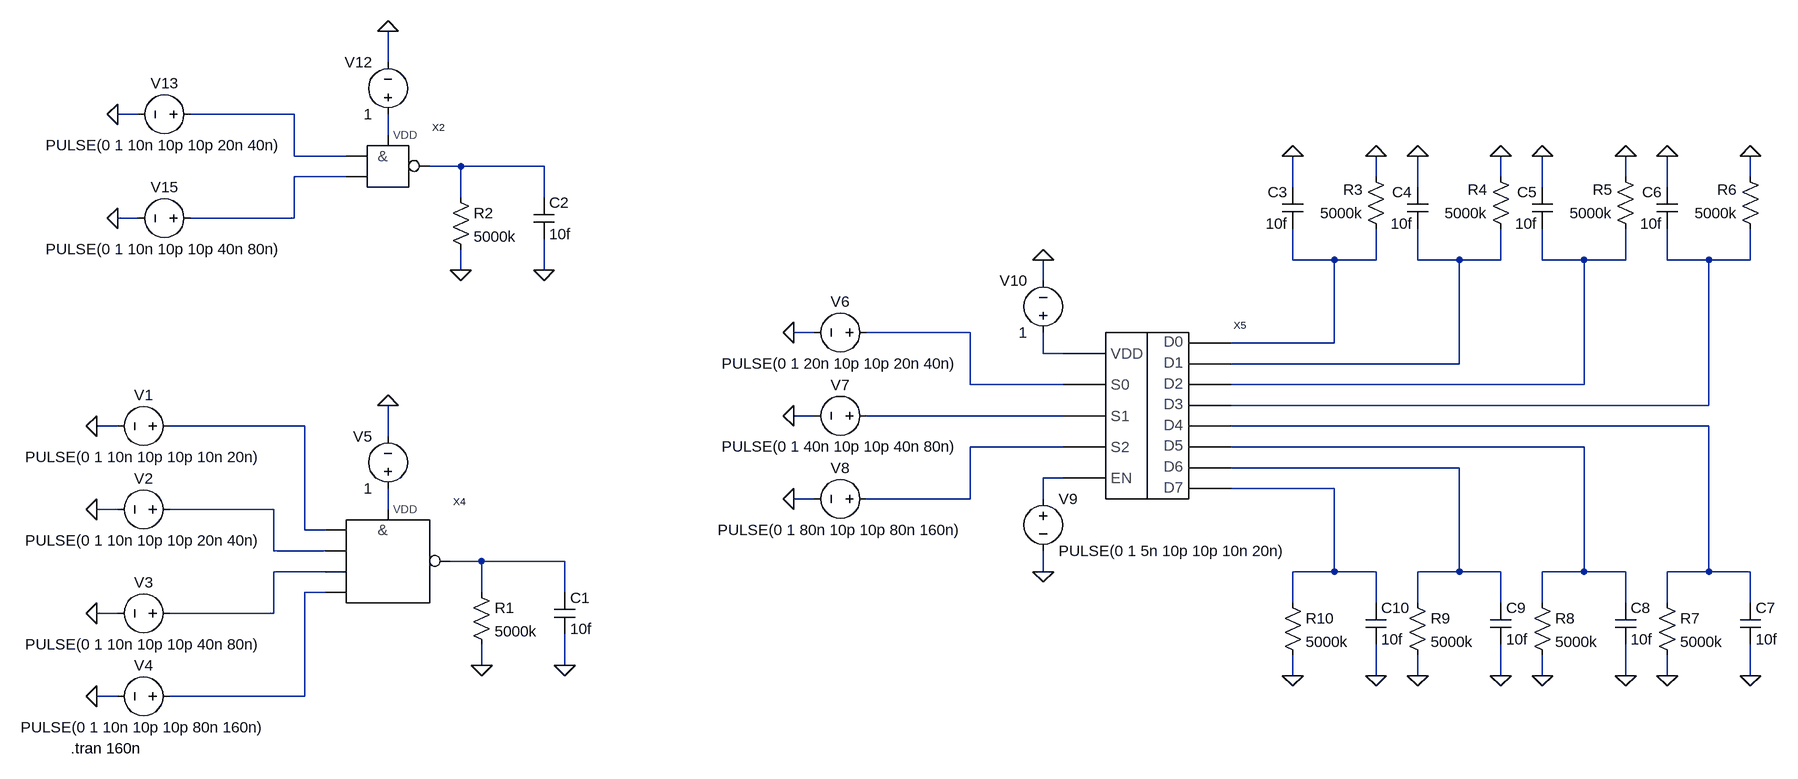
[diagram p0: schematic Draft4.asc]
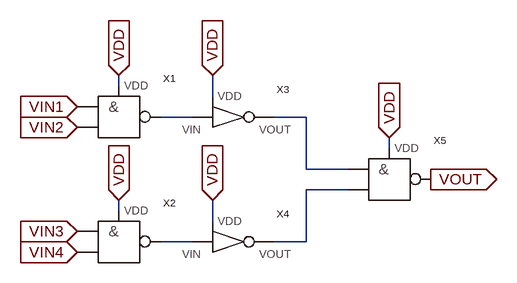
[diagram p1: sub-circuit nand_4.asc]
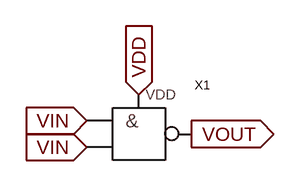
[diagram p2: sub-circuit inverter_2.asc]
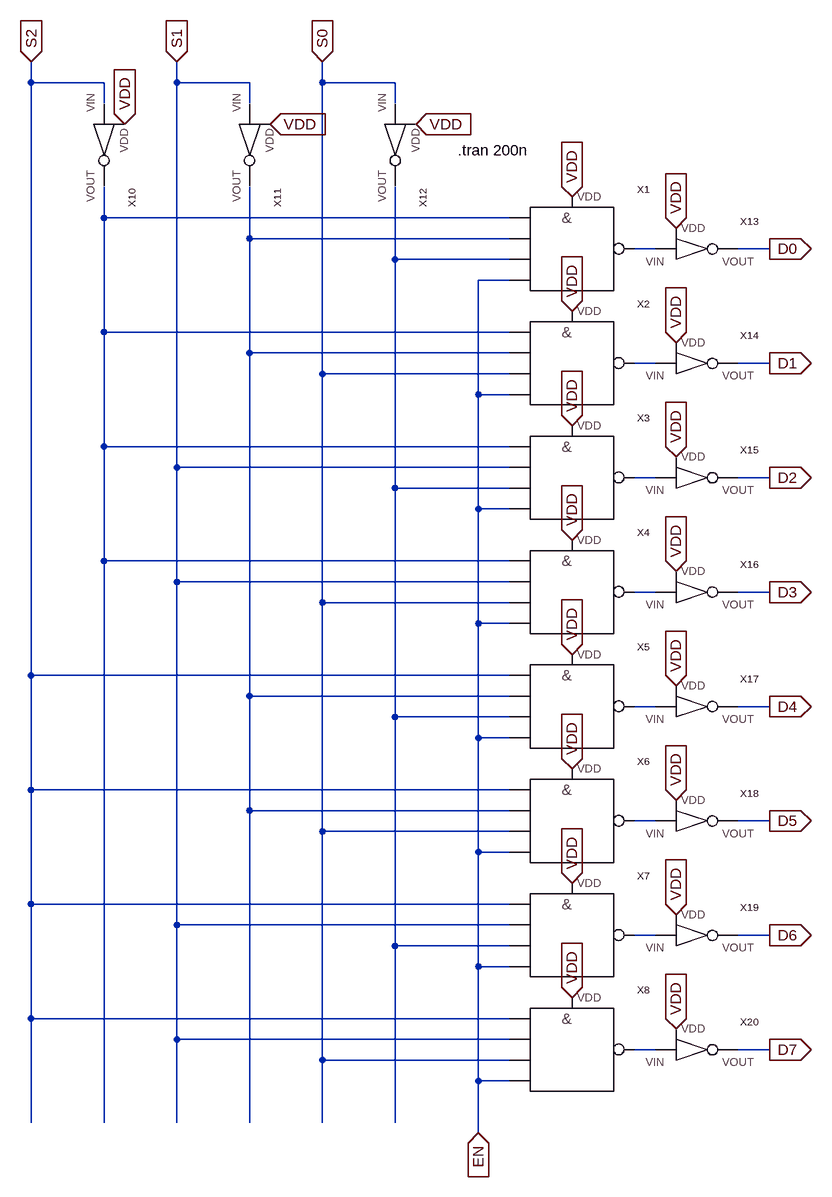
[diagram p3: sub-circuit decoder.asc]
Draft4.asc, the LTspice schematic file:
Version 4
SHEET 1 2400 680
WIRE 256 -592 256 -640
WIRE -128 -512 -160 -512
WIRE 112 -512 -48 -512
WIRE 256 -480 256 -512
WIRE 112 -448 112 -512
WIRE 192 -448 112 -448
WIRE 368 -432 320 -432
WIRE 496 -432 368 -432
WIRE 192 -416 112 -416
WIRE 1776 -416 1776 -448
WIRE 1968 -416 1968 -448
WIRE 2160 -416 2160 -448
WIRE 2352 -416 2352 -448
WIRE 1648 -400 1648 -448
WIRE 1840 -400 1840 -448
WIRE 2032 -400 2032 -448
WIRE 2224 -400 2224 -448
WIRE 368 -384 368 -432
WIRE 496 -384 496 -432
WIRE -128 -352 -160 -352
WIRE 112 -352 112 -416
WIRE 112 -352 -48 -352
WIRE 1648 -288 1648 -336
WIRE 1712 -288 1648 -288
WIRE 1776 -288 1776 -336
WIRE 1776 -288 1712 -288
WIRE 1840 -288 1840 -336
WIRE 1904 -288 1840 -288
WIRE 1968 -288 1968 -336
WIRE 1968 -288 1904 -288
WIRE 2032 -288 2032 -336
WIRE 2096 -288 2032 -288
WIRE 2160 -288 2160 -336
WIRE 2160 -288 2096 -288
WIRE 2224 -288 2224 -336
WIRE 2288 -288 2224 -288
WIRE 2352 -288 2352 -336
WIRE 2352 -288 2288 -288
WIRE 368 -272 368 -304
WIRE 496 -272 496 -320
WIRE 1264 -256 1264 -288
WIRE 912 -176 880 -176
WIRE 1152 -176 992 -176
WIRE 1712 -160 1712 -288
WIRE 1712 -160 1552 -160
WIRE 1264 -144 1264 -176
WIRE 1296 -144 1264 -144
WIRE 1904 -128 1904 -288
WIRE 1904 -128 1552 -128
WIRE 1152 -96 1152 -176
WIRE 1296 -96 1152 -96
WIRE 2096 -96 2096 -288
WIRE 2096 -96 1552 -96
WIRE 2288 -64 2288 -288
WIRE 2288 -64 1552 -64
WIRE 912 -48 880 -48
WIRE 1296 -48 992 -48
WIRE -160 -32 -192 -32
WIRE 128 -32 -80 -32
WIRE 2288 -32 1552 -32
WIRE 256 -16 256 -64
WIRE 1296 0 1152 0
WIRE 2096 0 1552 0
WIRE 1904 32 1552 32
WIRE 1296 48 1264 48
WIRE 1712 64 1552 64
WIRE 912 80 880 80
WIRE 1152 80 1152 0
WIRE 1152 80 992 80
WIRE 1264 80 1264 48
WIRE -160 96 -192 96
WIRE 80 96 -80 96
WIRE 256 96 256 64
WIRE 128 128 128 -32
WIRE 160 128 128 128
WIRE 80 160 80 96
WIRE 160 160 80 160
WIRE 400 176 352 176
WIRE 528 176 400 176
WIRE 160 192 80 192
WIRE 1264 192 1264 160
WIRE 1712 192 1712 64
WIRE 1712 192 1648 192
WIRE 1776 192 1712 192
WIRE 1904 192 1904 32
WIRE 1904 192 1840 192
WIRE 1968 192 1904 192
WIRE 2096 192 2096 0
WIRE 2096 192 2032 192
WIRE 2160 192 2096 192
WIRE 2288 192 2288 -32
WIRE 2288 192 2224 192
WIRE 2352 192 2288 192
WIRE 160 224 128 224
WIRE 400 224 400 176
WIRE 528 224 528 176
WIRE 1648 240 1648 192
WIRE 1776 240 1776 192
WIRE 1840 240 1840 192
WIRE 1968 240 1968 192
WIRE 2032 240 2032 192
WIRE 2160 240 2160 192
WIRE 2224 240 2224 192
WIRE 2352 240 2352 192
WIRE -160 256 -192 256
WIRE 80 256 80 192
WIRE 80 256 -80 256
WIRE 400 336 400 304
WIRE 528 336 528 288
WIRE 1648 352 1648 320
WIRE 1776 352 1776 304
WIRE 1840 352 1840 320
WIRE 1968 352 1968 304
WIRE 2032 352 2032 320
WIRE 2160 352 2160 304
WIRE 2224 352 2224 320
WIRE 2352 352 2352 304
WIRE -160 384 -192 384
WIRE 128 384 128 224
WIRE 128 384 -80 384
FLAG -192 -32 0
FLAG 256 -64 0
FLAG 528 336 0
FLAG 400 336 0
FLAG -192 96 0
FLAG -192 384 0
FLAG -192 256 0
FLAG 880 -176 0
FLAG 880 -48 0
FLAG 880 80 0
FLAG 1264 192 0
FLAG 1264 -288 0
FLAG 256 -640 0
FLAG 496 -272 0
FLAG 368 -272 0
FLAG -160 -512 0
FLAG -160 -352 0
FLAG 1648 -448 0
FLAG 1776 -448 0
FLAG 1840 -448 0
FLAG 1968 -448 0
FLAG 2032 -448 0
FLAG 2160 -448 0
FLAG 2224 -448 0
FLAG 2352 -448 0
FLAG 2352 352 0
FLAG 2224 352 0
FLAG 2160 352 0
FLAG 2032 352 0
FLAG 1968 352 0
FLAG 1840 352 0
FLAG 1776 352 0
FLAG 1648 352 0
SYMBOL voltage -64 -32 R90
WINDOW 0 -32 56 VBottom 2
WINDOW 3 32 56 VTop 2
WINDOW 123 0 0 Left 0
WINDOW 39 0 0 Left 0
SYMATTR InstName V1
SYMATTR Value PULSE(0 1 10n 10p 10p 10n 20n)
SYMBOL voltage 256 80 R180
WINDOW 0 24 96 Left 2
WINDOW 3 24 16 Left 2
WINDOW 123 0 0 Left 0
WINDOW 39 0 0 Left 0
SYMATTR InstName V5
SYMATTR Value 1
SYMBOL res 384 208 R0
SYMATTR InstName R1
SYMATTR Value 5000k
SYMBOL cap 512 224 R0
SYMATTR InstName C1
SYMATTR Value 10f
SYMBOL voltage -64 96 R90
WINDOW 0 -32 56 VBottom 2
WINDOW 3 32 56 VTop 2
WINDOW 123 0 0 Left 0
WINDOW 39 0 0 Left 0
SYMATTR InstName V2
SYMATTR Value PULSE(0 1 10n 10p 10p 20n 40n)
SYMBOL voltage -64 384 R90
WINDOW 0 -32 56 VBottom 2
WINDOW 3 32 56 VTop 2
WINDOW 123 0 0 Left 0
WINDOW 39 0 0 Left 0
SYMATTR InstName V4
SYMATTR Value PULSE(0 1 10n 10p 10p 80n 160n)
SYMBOL voltage -64 256 R90
WINDOW 0 -32 56 VBottom 2
WINDOW 3 32 56 VTop 2
WINDOW 123 0 0 Left 0
WINDOW 39 0 0 Left 0
SYMATTR InstName V3
SYMATTR Value PULSE(0 1 10n 10p 10p 40n 80n)
SYMBOL voltage 1008 -48 R90
WINDOW 0 -32 56 VBottom 2
WINDOW 3 32 56 VTop 2
WINDOW 123 0 0 Left 0
WINDOW 39 0 0 Left 0
SYMATTR InstName V7
SYMATTR Value PULSE(0 1 40n 10p 10p 40n 80n)
SYMBOL voltage 1008 -176 M270
WINDOW 0 32 56 VTop 2
WINDOW 3 -32 56 VBottom 2
WINDOW 123 0 0 Left 0
WINDOW 39 0 0 Left 0
SYMATTR InstName V6
SYMATTR Value PULSE(0 1 20n 10p 10p 20n 40n)
SYMBOL voltage 1008 80 R90
WINDOW 0 -32 56 VBottom 2
WINDOW 3 32 56 VTop 2
WINDOW 123 0 0 Left 0
WINDOW 39 0 0 Left 0
SYMATTR InstName V8
SYMATTR Value PULSE(0 1 80n 10p 10p 80n 160n)
SYMBOL voltage 1264 64 R0
WINDOW 123 0 0 Left 0
WINDOW 39 0 0 Left 0
SYMATTR InstName V9
SYMATTR Value PULSE(0 1 5n 10p 10p 10n 20n)
SYMBOL voltage 1264 -160 R180
WINDOW 0 24 96 Left 2
WINDOW 3 24 16 Left 2
WINDOW 123 0 0 Left 0
WINDOW 39 0 0 Left 0
SYMATTR InstName V10
SYMATTR Value 1
SYMBOL nand_2 256 -432 R0
SYMATTR InstName X2
SYMBOL nand_4 224 144 R0
SYMATTR InstName X4
SYMBOL decoder 1408 -80 R0
SYMATTR InstName X5
SYMBOL voltage 256 -496 R180
WINDOW 0 24 96 Left 2
WINDOW 3 24 16 Left 2
WINDOW 123 0 0 Left 0
WINDOW 39 0 0 Left 0
SYMATTR InstName V12
SYMATTR Value 1
SYMBOL res 352 -400 R0
SYMATTR InstName R2
SYMATTR Value 5000k
SYMBOL cap 480 -384 R0
SYMATTR InstName C2
SYMATTR Value 10f
SYMBOL voltage -32 -512 R90
WINDOW 0 -32 56 VBottom 2
WINDOW 3 32 56 VTop 2
WINDOW 123 0 0 Left 0
WINDOW 39 0 0 Left 0
SYMATTR InstName V13
SYMATTR Value PULSE(0 1 10n 10p 10p 20n 40n)
SYMBOL voltage -32 -352 R90
WINDOW 0 -32 56 VBottom 2
WINDOW 3 32 56 VTop 2
WINDOW 123 0 0 Left 0
WINDOW 39 0 0 Left 0
SYMATTR InstName V15
SYMATTR Value PULSE(0 1 10n 10p 10p 40n 80n)
SYMBOL res 1792 -320 R180
WINDOW 0 36 76 Left 2
WINDOW 3 36 40 Left 2
SYMATTR InstName R3
SYMATTR Value 5000k
SYMBOL cap 1664 -336 R180
WINDOW 0 24 56 Left 2
WINDOW 3 24 8 Left 2
SYMATTR InstName C3
SYMATTR Value 10f
SYMBOL res 1984 -320 R180
WINDOW 0 36 76 Left 2
WINDOW 3 36 40 Left 2
SYMATTR InstName R4
SYMATTR Value 5000k
SYMBOL cap 1856 -336 R180
WINDOW 0 24 56 Left 2
WINDOW 3 24 8 Left 2
SYMATTR InstName C4
SYMATTR Value 10f
SYMBOL res 2176 -320 R180
WINDOW 0 36 76 Left 2
WINDOW 3 36 40 Left 2
SYMATTR InstName R5
SYMATTR Value 5000k
SYMBOL cap 2048 -336 R180
WINDOW 0 24 56 Left 2
WINDOW 3 24 8 Left 2
SYMATTR InstName C5
SYMATTR Value 10f
SYMBOL res 2368 -320 R180
WINDOW 0 36 76 Left 2
WINDOW 3 36 40 Left 2
SYMATTR InstName R6
SYMATTR Value 5000k
SYMBOL cap 2240 -336 R180
WINDOW 0 24 56 Left 2
WINDOW 3 24 8 Left 2
SYMATTR InstName C6
SYMATTR Value 10f
SYMBOL res 2208 224 R0
SYMATTR InstName R7
SYMATTR Value 5000k
SYMBOL cap 2336 240 R0
SYMATTR InstName C7
SYMATTR Value 10f
SYMBOL res 2016 224 R0
SYMATTR InstName R8
SYMATTR Value 5000k
SYMBOL cap 2144 240 R0
SYMATTR InstName C8
SYMATTR Value 10f
SYMBOL res 1824 224 R0
SYMATTR InstName R9
SYMATTR Value 5000k
SYMBOL cap 1952 240 R0
SYMATTR InstName C9
SYMATTR Value 10f
SYMBOL res 1632 224 R0
SYMATTR InstName R10
SYMATTR Value 5000k
SYMBOL cap 1760 240 R0
SYMATTR InstName C10
SYMATTR Value 10f
TEXT -232 464 Left 2 !.tran 160n

nand_4.asc, the sub-circuit schematic file:
Version 4
SHEET 1 1884 788
WIRE 544 224 544 208
WIRE 688 240 688 208
WIRE 656 272 608 272
WIRE 832 272 784 272
WIRE 960 320 960 304
WIRE 832 352 832 272
WIRE 896 352 832 352
WIRE 896 384 832 384
WIRE 544 416 544 400
WIRE 688 432 688 400
WIRE 656 464 608 464
WIRE 832 464 832 384
WIRE 832 464 784 464
FLAG 480 256 VIN1
IOPIN 480 256 In
FLAG 480 288 VIN2
IOPIN 480 288 In
FLAG 544 208 VDD
IOPIN 544 208 In
FLAG 688 208 VDD
IOPIN 688 208 In
FLAG 480 448 VIN3
IOPIN 480 448 In
FLAG 480 480 VIN4
IOPIN 480 480 In
FLAG 544 400 VDD
IOPIN 544 400 In
FLAG 688 400 VDD
IOPIN 688 400 In
FLAG 960 304 VDD
IOPIN 960 304 In
FLAG 1024 368 VOUT
IOPIN 1024 368 Out
SYMBOL nand_2 544 272 R0
SYMATTR InstName X1
SYMBOL inverter_2 640 272 R0
SYMATTR InstName X3
SYMBOL nand_2 544 464 R0
SYMATTR InstName X2
SYMBOL inverter_2 640 464 R0
SYMATTR InstName X4
SYMBOL nand_2 960 368 R0
SYMATTR InstName X5

inverter_2.asc, the sub-circuit schematic file:
Version 4
SHEET 1 880 680
FLAG 16 48 VIN
IOPIN 16 48 In
FLAG 16 80 VIN
IOPIN 16 80 In
FLAG 80 16 VDD
IOPIN 80 16 In
FLAG 144 64 VOUT
IOPIN 144 64 Out
SYMBOL nand_2 80 64 R0
SYMATTR InstName X1

decoder.asc, the sub-circuit schematic file:
Version 4
SHEET 1 1684 1836
WIRE 272 128 272 96
WIRE 384 128 272 128
WIRE 496 128 496 96
WIRE 608 128 496 128
WIRE 720 128 720 96
WIRE 832 128 720 128
WIRE 384 160 384 128
WIRE 608 160 608 128
WIRE 832 160 832 128
WIRE 384 336 384 288
WIRE 1008 336 384 336
WIRE 608 368 608 288
WIRE 1008 368 608 368
WIRE 1232 384 1200 384
WIRE 1408 384 1360 384
WIRE 832 400 832 288
WIRE 1008 400 832 400
WIRE 1008 432 960 432
WIRE 384 512 384 336
WIRE 1008 512 384 512
WIRE 608 544 608 368
WIRE 1008 544 608 544
WIRE 1232 560 1200 560
WIRE 1408 560 1360 560
WIRE 720 576 720 128
WIRE 1008 576 720 576
WIRE 960 608 960 432
WIRE 1008 608 960 608
WIRE 384 688 384 512
WIRE 1008 688 384 688
WIRE 496 720 496 128
WIRE 1008 720 496 720
WIRE 1232 736 1200 736
WIRE 1408 736 1360 736
WIRE 832 752 832 400
WIRE 1008 752 832 752
WIRE 960 784 960 608
WIRE 1008 784 960 784
WIRE 384 864 384 688
WIRE 1008 864 384 864
WIRE 496 896 496 720
WIRE 1008 896 496 896
WIRE 1232 912 1200 912
WIRE 1408 912 1360 912
WIRE 720 928 720 576
WIRE 1008 928 720 928
WIRE 960 960 960 784
WIRE 1008 960 960 960
WIRE 272 1040 272 128
WIRE 1008 1040 272 1040
WIRE 608 1072 608 544
WIRE 1008 1072 608 1072
WIRE 1232 1088 1200 1088
WIRE 1408 1088 1360 1088
WIRE 832 1104 832 752
WIRE 1008 1104 832 1104
WIRE 960 1136 960 960
WIRE 1008 1136 960 1136
WIRE 272 1216 272 1040
WIRE 1008 1216 272 1216
WIRE 608 1248 608 1072
WIRE 1008 1248 608 1248
WIRE 1232 1264 1200 1264
WIRE 1408 1264 1360 1264
WIRE 720 1280 720 928
WIRE 1008 1280 720 1280
WIRE 960 1312 960 1136
WIRE 1008 1312 960 1312
WIRE 272 1392 272 1216
WIRE 1008 1392 272 1392
WIRE 496 1424 496 896
WIRE 1008 1424 496 1424
WIRE 1232 1440 1200 1440
WIRE 1408 1440 1360 1440
WIRE 832 1456 832 1104
WIRE 1008 1456 832 1456
WIRE 960 1488 960 1312
WIRE 1008 1488 960 1488
WIRE 272 1568 272 1392
WIRE 1008 1568 272 1568
WIRE 496 1600 496 1424
WIRE 1008 1600 496 1600
WIRE 1232 1616 1200 1616
WIRE 1408 1616 1360 1616
WIRE 720 1632 720 1280
WIRE 1008 1632 720 1632
WIRE 960 1664 960 1488
WIRE 1008 1664 960 1664
WIRE 272 1728 272 1568
WIRE 384 1728 384 864
WIRE 496 1728 496 1600
WIRE 608 1728 608 1248
WIRE 720 1728 720 1632
WIRE 832 1728 832 1456
WIRE 960 1744 960 1664
FLAG 272 96 S2
IOPIN 272 96 In
FLAG 496 96 S1
IOPIN 496 96 In
FLAG 720 96 S0
IOPIN 720 96 In
FLAG 1408 384 D0
IOPIN 1408 384 Out
FLAG 1408 560 D1
IOPIN 1408 560 Out
FLAG 1408 736 D2
IOPIN 1408 736 Out
FLAG 1408 912 D3
IOPIN 1408 912 Out
FLAG 1408 1088 D4
IOPIN 1408 1088 Out
FLAG 1408 1264 D5
IOPIN 1408 1264 Out
FLAG 1408 1440 D6
IOPIN 1408 1440 Out
FLAG 1408 1616 D7
IOPIN 1408 1616 Out
FLAG 416 192 VDD
IOPIN 416 192 In
FLAG 640 192 VDD
IOPIN 640 192 In
FLAG 864 192 VDD
IOPIN 864 192 In
FLAG 1104 304 VDD
IOPIN 1104 304 In
FLAG 1104 480 VDD
IOPIN 1104 480 In
FLAG 1104 656 VDD
IOPIN 1104 656 In
FLAG 1104 832 VDD
IOPIN 1104 832 In
FLAG 1104 1008 VDD
IOPIN 1104 1008 In
FLAG 1104 1184 VDD
IOPIN 1104 1184 In
FLAG 1104 1360 VDD
IOPIN 1104 1360 In
FLAG 1104 1536 VDD
IOPIN 1104 1536 In
FLAG 960 1744 EN
IOPIN 960 1744 In
FLAG 1264 352 VDD
IOPIN 1264 352 In
FLAG 1264 528 VDD
IOPIN 1264 528 In
FLAG 1264 704 VDD
IOPIN 1264 704 In
FLAG 1264 880 VDD
IOPIN 1264 880 In
FLAG 1264 1056 VDD
IOPIN 1264 1056 In
FLAG 1264 1232 VDD
IOPIN 1264 1232 In
FLAG 1264 1408 VDD
IOPIN 1264 1408 In
FLAG 1264 1584 VDD
IOPIN 1264 1584 In
SYMBOL inverter_2 384 144 R90
SYMATTR InstName X10
SYMBOL inverter_2 608 144 R90
SYMATTR InstName X11
SYMBOL inverter_2 832 144 R90
SYMATTR InstName X12
SYMBOL nand_4 1072 352 R0
SYMATTR InstName X1
SYMBOL nand_4 1072 528 R0
SYMATTR InstName X2
SYMBOL nand_4 1072 704 R0
SYMATTR InstName X3
SYMBOL nand_4 1072 880 R0
SYMATTR InstName X4
SYMBOL nand_4 1072 1056 R0
SYMATTR InstName X5
SYMBOL nand_4 1072 1232 R0
SYMATTR InstName X6
SYMBOL nand_4 1072 1408 R0
SYMATTR InstName X7
SYMBOL nand_4 1072 1584 R0
SYMATTR InstName X8
SYMBOL inverter_2 1216 384 R0
SYMATTR InstName X13
SYMBOL inverter_2 1216 560 R0
SYMATTR InstName X14
SYMBOL inverter_2 1216 736 R0
SYMATTR InstName X15
SYMBOL inverter_2 1216 912 R0
SYMATTR InstName X16
SYMBOL inverter_2 1216 1088 R0
SYMATTR InstName X17
SYMBOL inverter_2 1216 1264 R0
SYMATTR InstName X18
SYMBOL inverter_2 1216 1440 R0
SYMATTR InstName X19
SYMBOL inverter_2 1216 1616 R0
SYMATTR InstName X20
TEXT 928 232 Left 2 !.tran 200n

The netlist it stands for:
* Draft4.asc
V1 N012 0 PULSE(0 1 10n 10p 10p 10n 20n)
V5 N020 0 1
R1 N021 0 5000k
C1 N021 0 10f
V2 N019 0 PULSE(0 1 10n 10p 10p 20n 40n)
V4 N023 0 PULSE(0 1 10n 10p 10p 80n 160n)
V3 N022 0 PULSE(0 1 10n 10p 10p 40n 80n)
V7 N011 0 PULSE(0 1 40n 10p 10p 40n 80n)
V6 N009 0 PULSE(0 1 20n 10p 10p 20n 40n)
V8 N014 0 PULSE(0 1 80n 10p 10p 80n 160n)
V9 N017 0 PULSE(0 1 5n 10p 10p 10n 20n)
V10 N010 0 1
XX2 N001 N004 N002 N003 nand_2  ; pins VIN1 VIN2 VDD VOUT
XX4 N012 N019 N022 N023 N020 N021 nand_4
XX5 N010 N009 N011 N014 N005 N007 N013 N016 N006 N008 N015 N018 N017 decoder
V12 N002 0 1
R2 N003 0 5000k
C2 N003 0 10f
V13 N001 0 PULSE(0 1 10n 10p 10p 20n 40n)
V15 N004 0 PULSE(0 1 10n 10p 10p 40n 80n)
R3 N005 0 5000k
C3 N005 0 10f
R4 N006 0 5000k
C4 N006 0 10f
R5 N007 0 5000k
C5 N007 0 10f
R6 N008 0 5000k
C6 N008 0 10f
R7 N013 0 5000k
C7 N013 0 10f
R8 N015 0 5000k
C8 N015 0 10f
R9 N016 0 5000k
C9 N016 0 10f
R10 N018 0 5000k
C10 N018 0 10f

* block symbol definitions
.subckt nand_4 VIN1 VIN2 VIN3 VIN4 VDD VOUT
XX1 VIN1 VIN2 VDD N001 nand_2  ; pins VIN1 VIN2 VDD VOUT
XX3 N001 VDD N002 inverter_2
XX2 VIN3 VIN4 VDD N004 nand_2  ; pins VIN1 VIN2 VDD VOUT
XX4 N004 VDD N003 inverter_2
XX5 N002 N003 VDD VOUT nand_2  ; pins VIN1 VIN2 VDD VOUT
.ends nand_4

.subckt inverter_2 VIN VDD VOUT
XX1 VIN VIN VDD VOUT nand_2  ; pins VIN1 VIN2 VDD VOUT
.ends inverter_2

.subckt decoder VDD S0 S1 S2 D0 D2 D4 D6 D1 D3 D5 D7 EN
XX10 S2 VDD N001 inverter_2
XX11 S1 VDD N002 inverter_2
XX12 S0 VDD N004 inverter_2
XX1 N001 N002 N004 EN VDD N003 nand_4
XX2 N001 N002 S0 EN VDD N005 nand_4
XX3 N001 S1 N004 EN VDD N006 nand_4
XX4 N001 S1 S0 EN VDD N007 nand_4
XX5 S2 N002 N004 EN VDD N008 nand_4
XX6 S2 N002 S0 EN VDD N009 nand_4
XX7 S2 S1 N004 EN VDD N010 nand_4
XX8 S2 S1 S0 EN VDD N011 nand_4
XX13 N003 VDD D0 inverter_2
XX14 N005 VDD D1 inverter_2
XX15 N006 VDD D2 inverter_2
XX16 N007 VDD D3 inverter_2
XX17 N008 VDD D4 inverter_2
XX18 N009 VDD D5 inverter_2
XX19 N010 VDD D6 inverter_2
XX20 N011 VDD D7 inverter_2
.tran 200n
.ends decoder

.tran 160n
.backanno
.end